# Altium schematic sheet VOLT_SW.SchDoc
size B; SheetNumber: 5; SheetTotal: 9
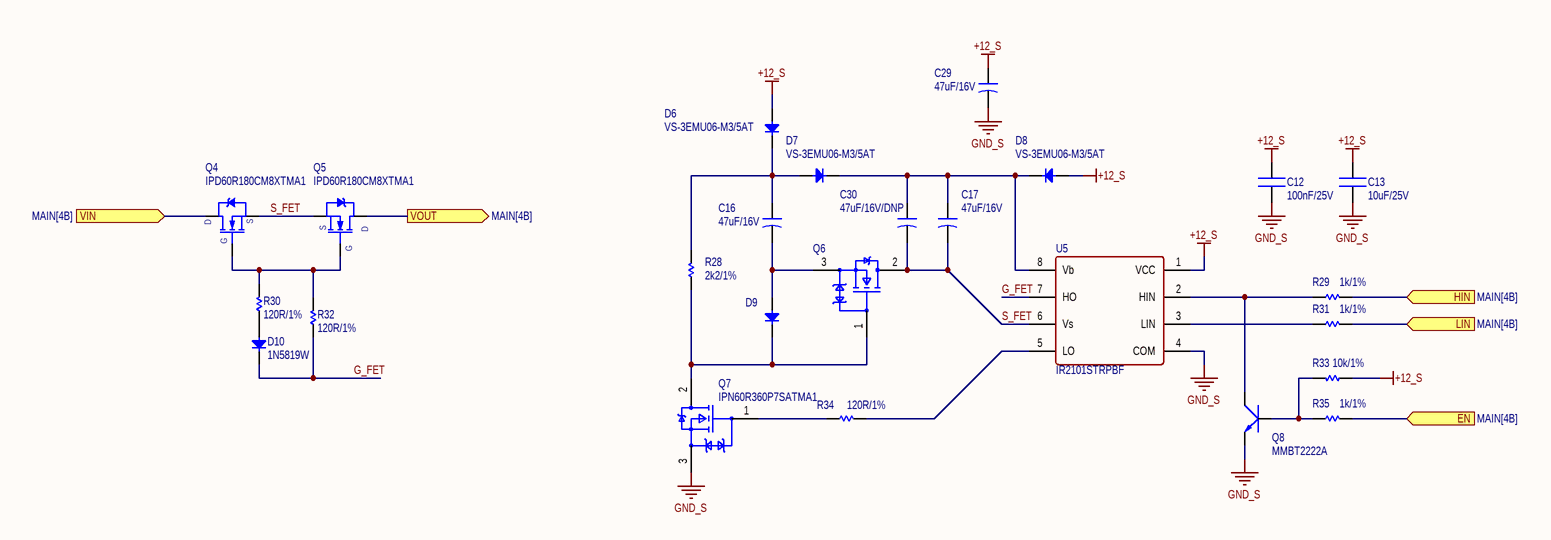
[diagram p0: VOLT_SW.SchDoc]

## Parts
C12  100nF/25V  [CN-SMD-0603]
C13  10uF/25V  [CN-SMD-0603]
C16  47uF/16V  [Tantalum 1210]
C17  47uF/16V  [Tantalum 1210]
C29  47uF/16V  [Tantalum 1210]
C30  47uF/16V/DNP  [Tantalum 1210]
D6  VS-3EMU06-M3/5AT  [DIO-SMD-A]
D7  VS-3EMU06-M3/5AT  [DIO-SMD-A]
D8  VS-3EMU06-M3/5AT  [DIO-SMD-A]
D9  VS-3EMU06-M3/5AT  [DIO-SMD-A]  (value not drawn)
D10  1N5819W  [DIO-SMD-123]
Q4  IPD60R180CM8XTMA1  [TO252-123]
Q5  IPD60R180CM8XTMA1  [TO252-123]
Q6  IPN60R360P7SATMA1  [SOT223-3]  (value not drawn)
Q7  IPN60R360P7SATMA1  [SOT223-3]
Q8  MMBT2222A  [SOT23-132]
R28  2k2/1%  [RES-SMD-0603]
R29  1k/1%  [RES-SMD-0603]
R30  120R/1%  [RES-SMD-0603]
R31  1k/1%  [RES-SMD-0603]
R32  120R/1%  [RES-SMD-0603]
R33  10k/1%  [RES-SMD-0603]
R34  120R/1%  [RES-SMD-0603]
R35  1k/1%  [RES-SMD-0603]
U5  IR2101STRPBF  [SO8]

## Ports
EN (in, see MAIN[4B]), HIN (in, see MAIN[4B]), LIN (in, see MAIN[4B]), VIN (in, see MAIN[4B]), VOUT (out, see MAIN[4B])

## Nets
+12_S: C12.2 C13.2 C29.1 D6.1(A) D8.1(A) R33.1 U5.1(VCC)
GND_S: C12.1 C13.1 C29.2 Q7.3(Source) Q8.2(E) U5.4(COM)
EN: R35.1 ; port EN
G_FET: D10.2(K) R32.1 U5.7(HO)
HIN: R29.1 ; port HIN
LIN: R31.1 ; port LIN
S_FET: C17.2 C30.2 Q4.3(S) Q5.3(S) Q6.2(Drain) U5.6(Vs)
VIN: Q4.2(D) ; port VIN
VOUT: Q5.2(D) ; port VOUT
NetC16_1: C16.1 D6.2(K) D7.1(A) R28.2
NetC16_2: C16.2 D9.1(A) Q6.3(Source)
NetC17_1: C17.1 C30.1 D7.2(K) D8.2(K) U5.8(Vb)
NetD9_2: D9.2(K) Q6.1(Gate) Q7.2(Drain) R28.1
NetD10_1: D10.1(A) R30.1
NetQ4_1: Q4.1(G) Q5.1(G) R30.2 R32.2
NetQ7_1: Q7.1(Gate) R34.1
NetQ8_1: Q8.1(B) R33.2 R35.2
NetQ8_3: Q8.3(C) R29.2 U5.2(HIN)
NetR31_2: R31.2 U5.3(LIN)
NetR34_2: R34.2 U5.5(LO)

## Library data of the parts
C12 = CN: CL10B104KA8NNNC; PN: CL10B104KA8NNNC
C13 = CN: 0603W106M250XD; PN: 0603W106M250XD
C16 C17 C29 = CN-SMD: TCNT476M016R0200; PN: TCNT476M016R0200; LatestRevisionDate: 17-Jul-2002; LatestRevisionNote: Re-released for DXP Platform.; PackageReference: POLAR0.8; Publisher: Altium Limited
C30 = CN-SMD: TCNT476M016R0200/DNP; PN: TCNT476M016R0200/DNP; LatestRevisionDate: 17-Jul-2002; LatestRevisionNote: Re-released for DXP Platform.; PackageReference: POLAR0.8; Publisher: Altium Limited
D6-D10 = Diode SMD: Code - JEDEC: DO-214-AB; Published: 8-Jun-2000; Revision: July-2002: Re-released for DXP Platform.; Publisher: Altium Limited
  D6-D9: PN: VS-3EMU06-M3/5AT
  D10: PN: 1N5819W
Q4 Q5 = FDD8870: PN: IPD60R180CM8XTMA1
Q6 Q7 = IPN60R360P7SATMA1: Manufacturer: Infineon; Max Junction Temp: +150°C; Number Of Channels: 1; Pulse Drain Current: 26A; Drain To Source Breakdown Voltage: 600V; Gate To Source Voltage: 20V; Depletion Mode: False; Typ Forward Diode Voltage: 0.9V; Gate Charge At Vgs: 13nC @ 10V; Turn Off Delay Time: 42ns; Input Capacitace At Vds: 555pF @ 400V; Power Dissipation: 7W; Drain To Source Resistance: 0.3Ω; Threshold Vgs Max: 4V; Drain To Source Voltage: 650V; Reverse Recovery Time: 145ns; Continuous Drain Current: 9A; Reverse Recovery Charge: 740nC; Rthja Max: 35°C/W; Turn On Delay Time: 8ns; Threshold Vgs Min: 3V; Device Class L3: MOSFETs; Device Class L2: Transistors; Manufacturer Part Number: IPN60R360P7SATMA1; PN: IPN60R360P7SATMA1; Footprint Url: https://www.infineon.com/cms/en/product/packages/PG-SOT223/PG-SOT223-3-1/; Category: Trans; Device Class L1: Discrete Semiconductors; Lead Free: Yes; ComponentLink2URL: https://www.infineon.com/dgdl/Infineon-IPN60R360P7S-DS-v02_00-EN.pdf?fileId=5546d4625cc9456a015cf3d550b26150; Temperature: -40°C to +150°C; Temperature Range High: +150°C; Temperature Range Low: -40°C; Automotive: No; ComponentLink2Description: Datasheet; Digikey Description: MOSFET N-CHANNEL 600V 9A SOT223; RoHS: TRUE; Package: PG-SOT223-3; Height: 1.8mm; Octopart: https://octopart.com/ipn60r360p7satma1-infineon-84309560
Q8 = 2SC1815: PN: MMBT2222A
R28 = Res-SMD: ERJ-3EKF2201V; Manufacturer: Generic Components; Class: Passive; PN: ERJ-3EKF2201V; Publisher: Altium Hobart Technology Centre
R29 R31 R35 = Res-SMD: ERJ-3EKF1001V; Manufacturer: Generic Components; Class: Passive; PN: ERJ-3EKF1001V; Publisher: Altium Hobart Technology Centre
R30 R32 R34 = Res-SMD: ERJ-3EKF1200V; Manufacturer: Generic Components; Class: Passive; PN: ERJ-3EKF1200V; Publisher: Altium Hobart Technology Centre
R33 = Res-SMD: ERJ-3EKF1002V; Manufacturer: Generic Components; Class: Passive; PN: ERJ-3EKF1002V; Publisher: Altium Hobart Technology Centre
U5 = IR2101S